# Altium schematic sheet ecar.SchDoc
size E
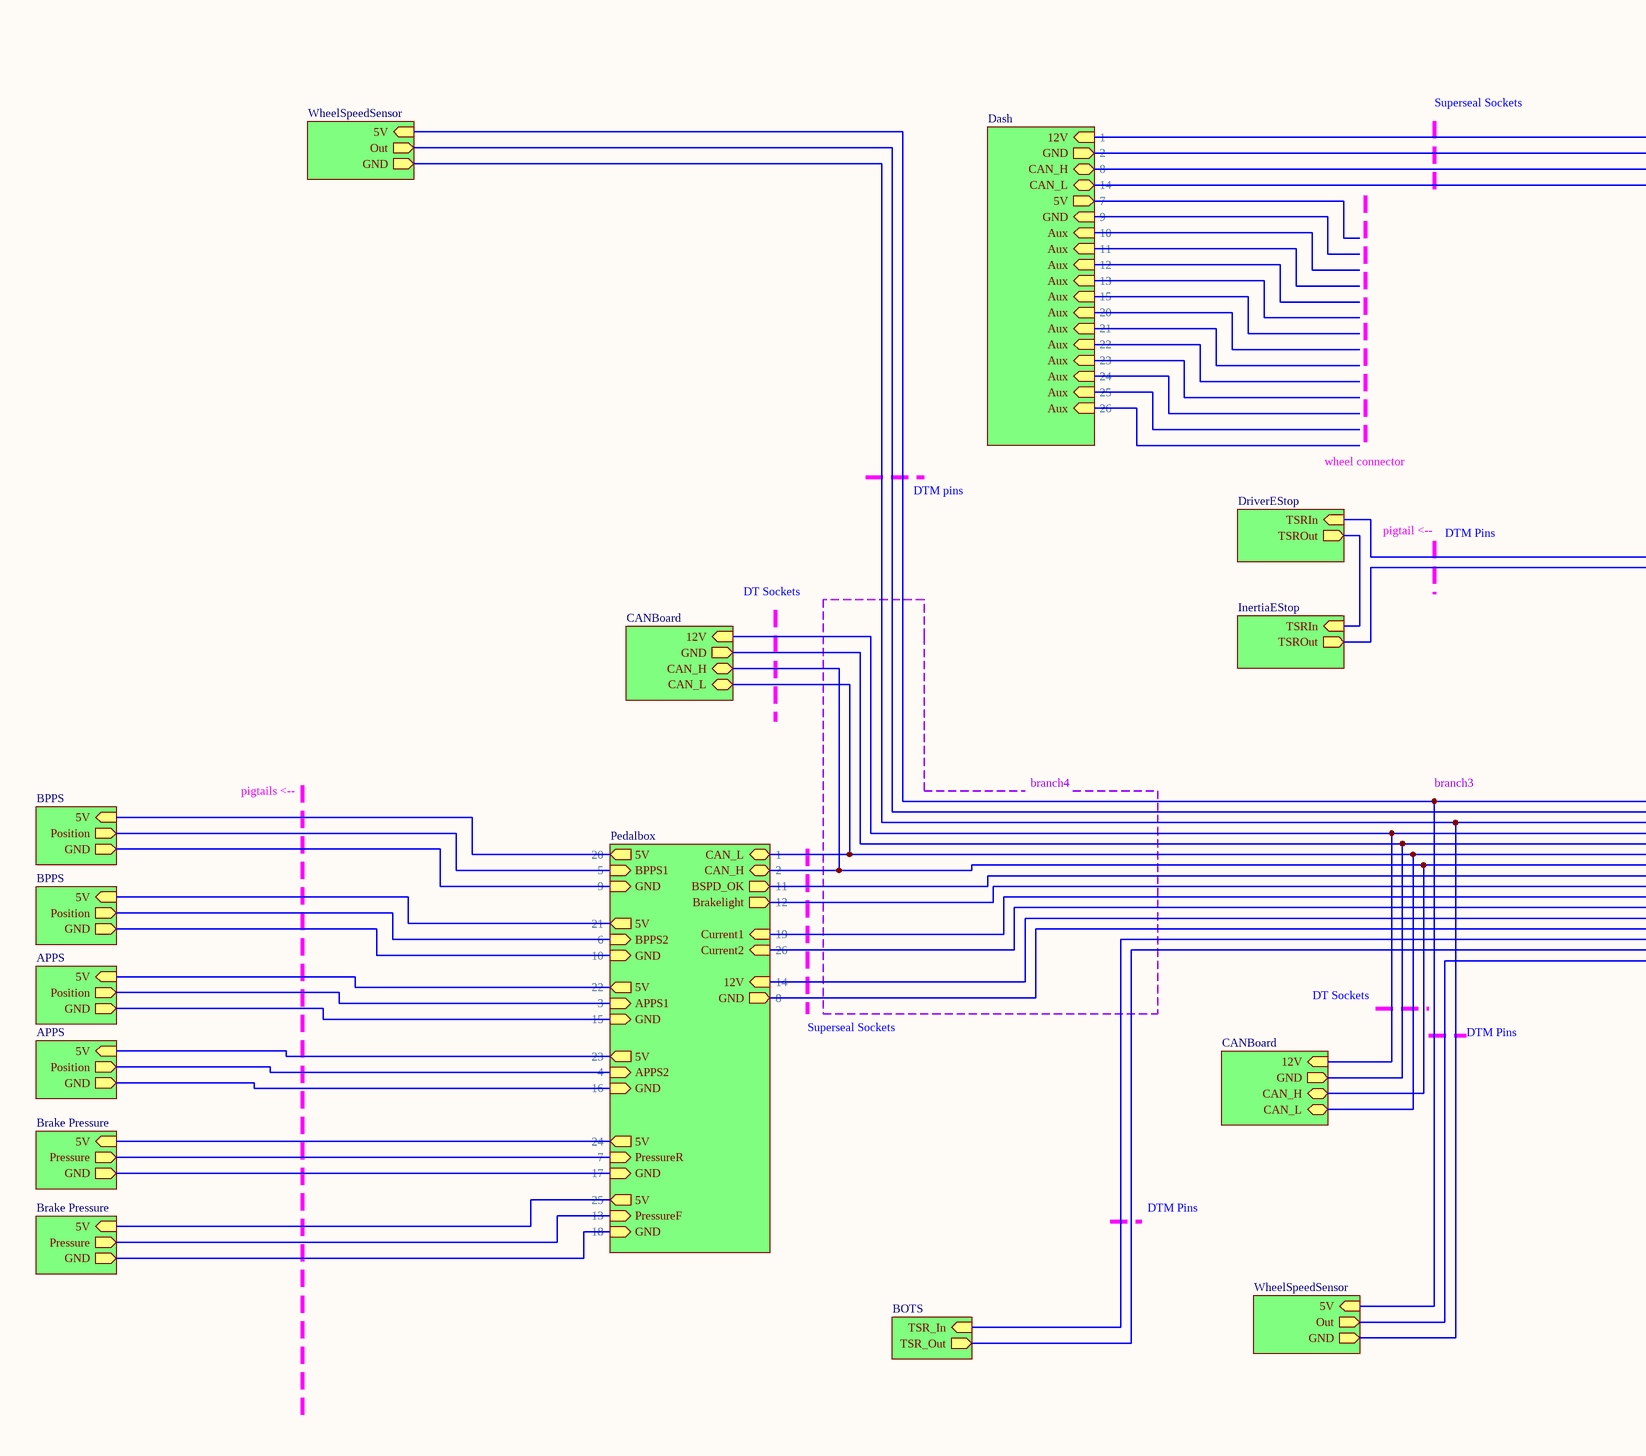
[diagram p0: ecar.SchDoc, top left]
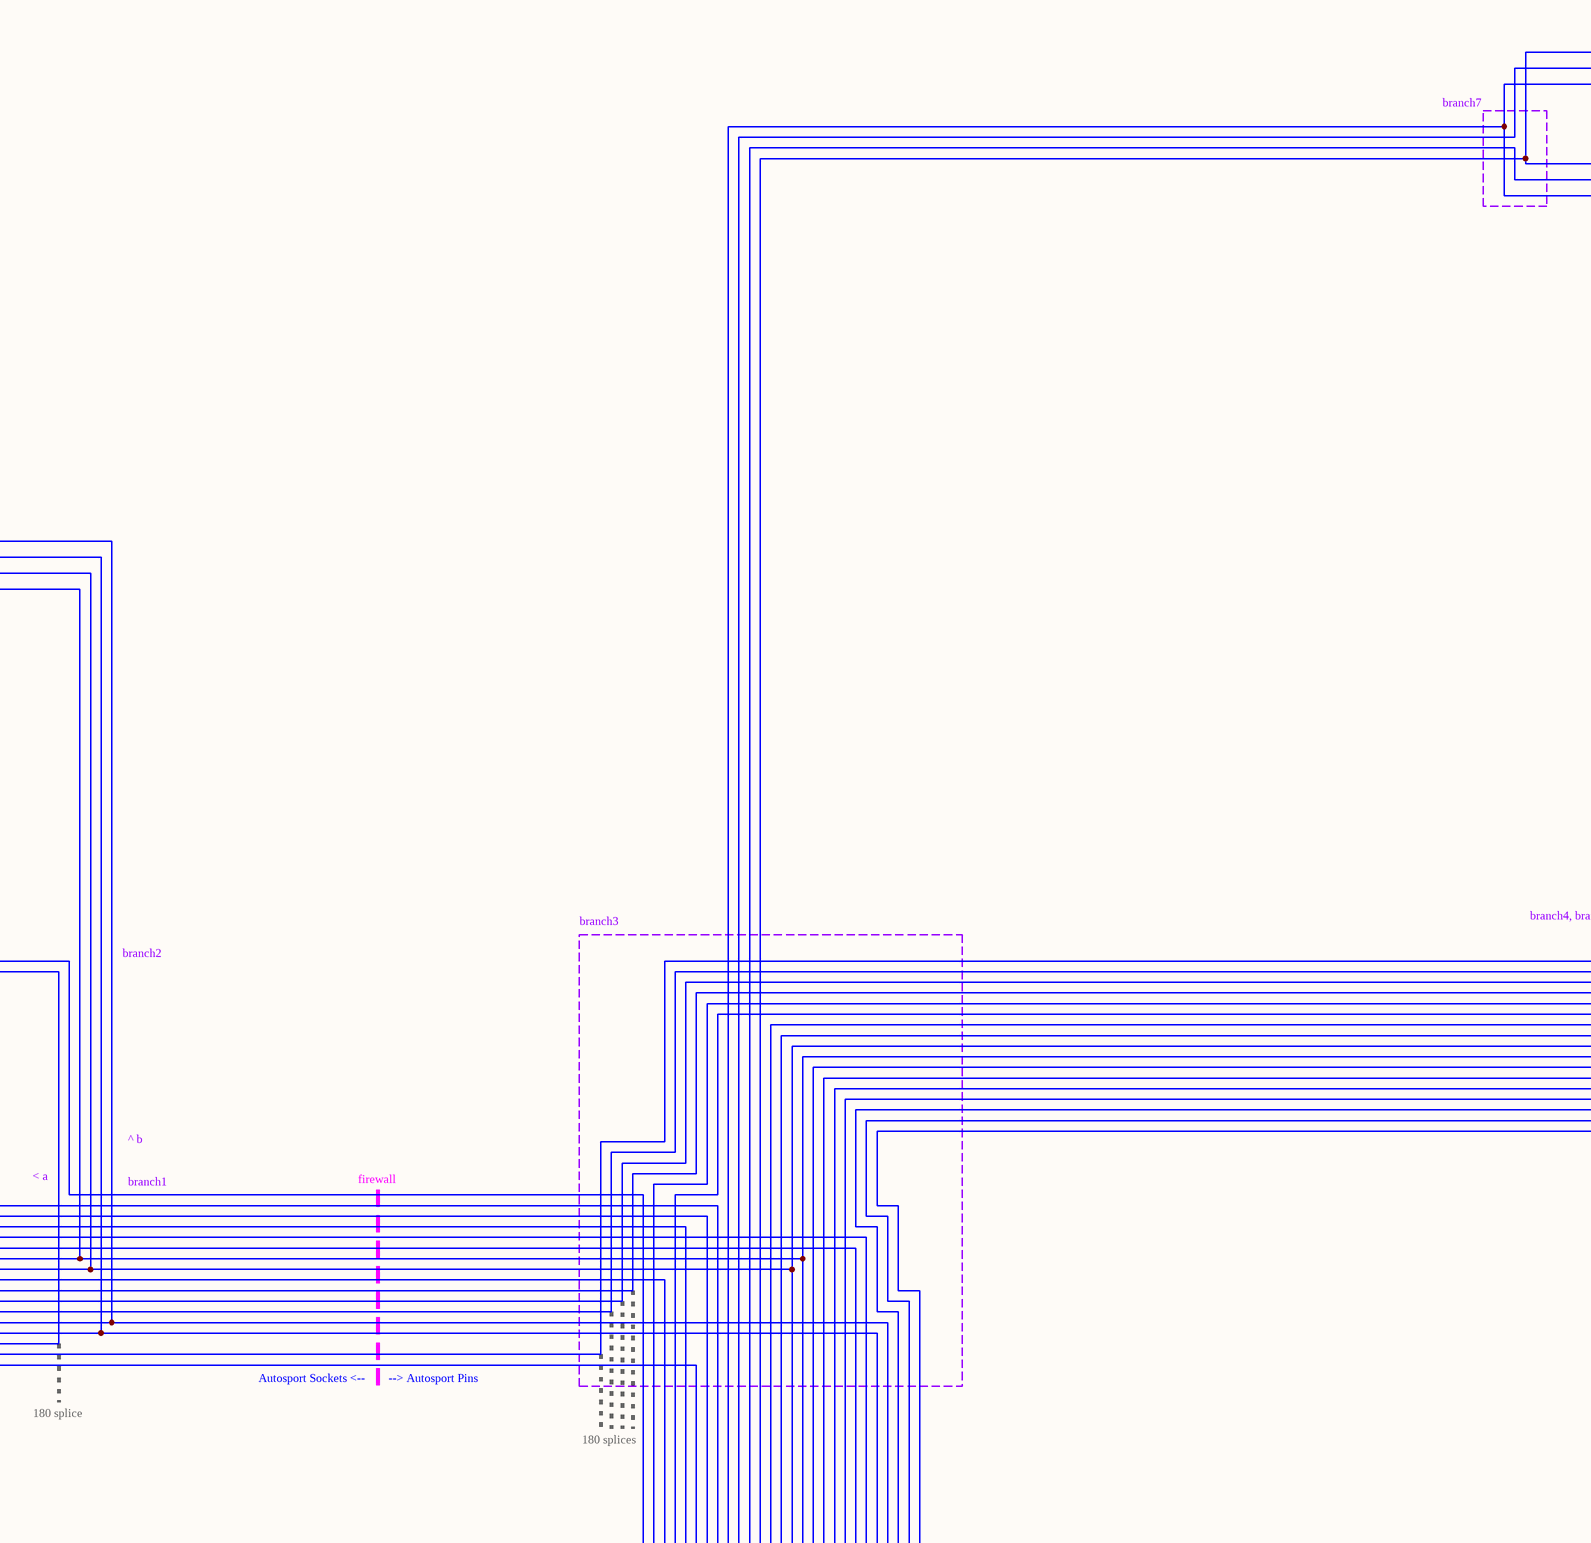
[diagram p1: ecar.SchDoc, top middle]
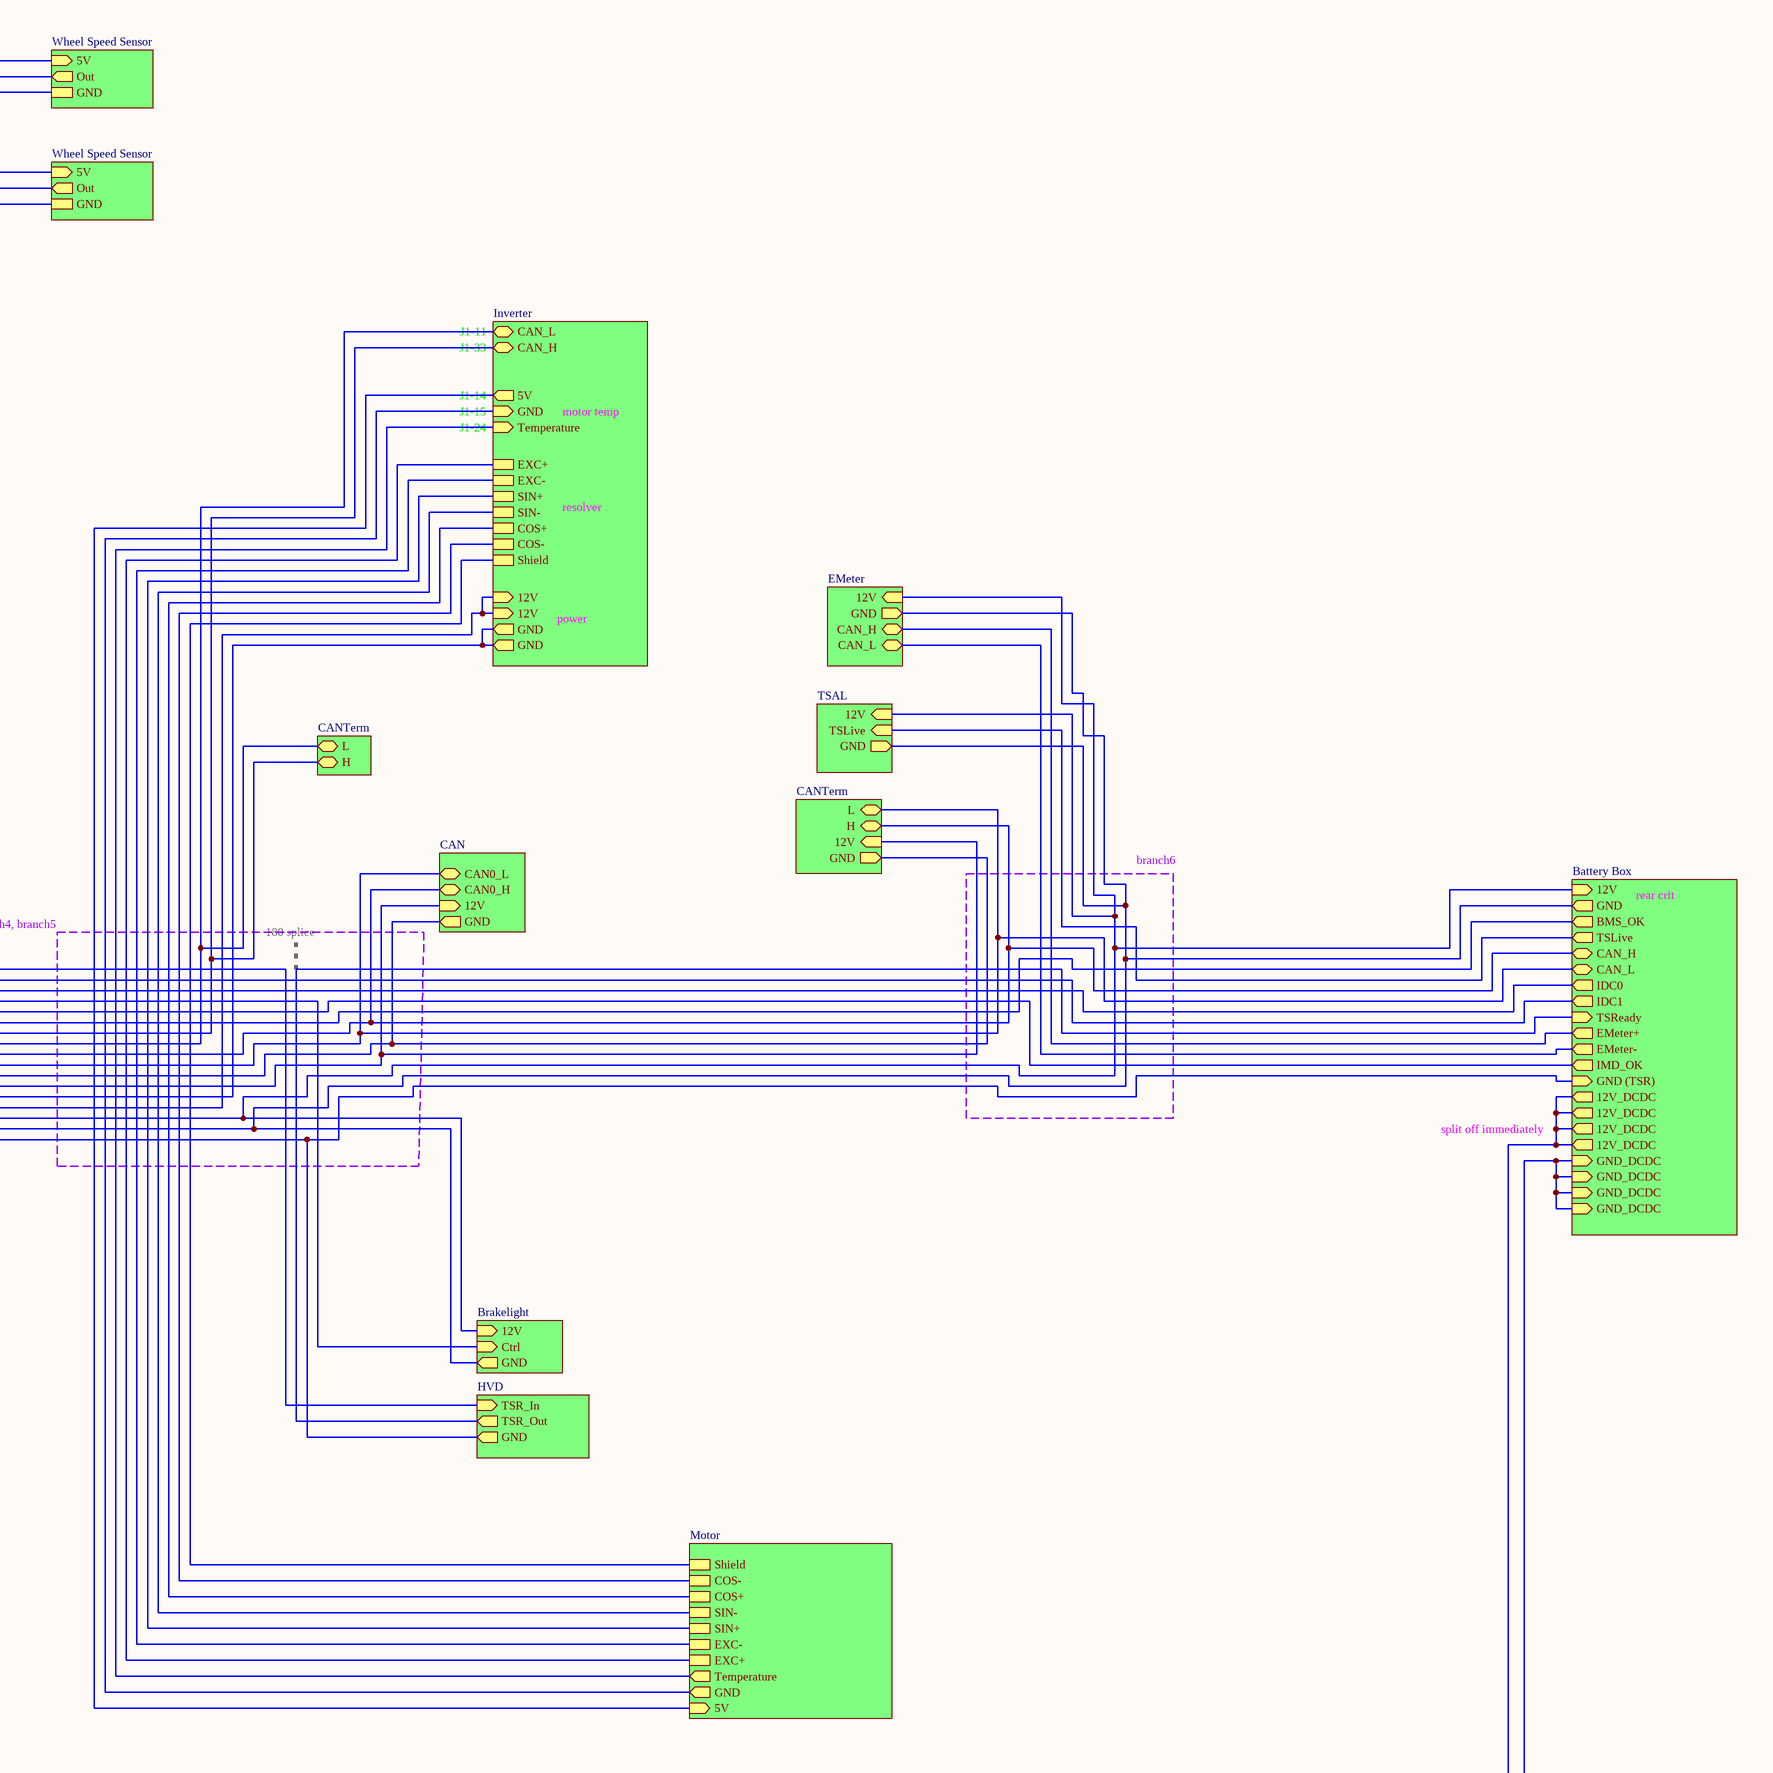
[diagram p2: ecar.SchDoc, top right]
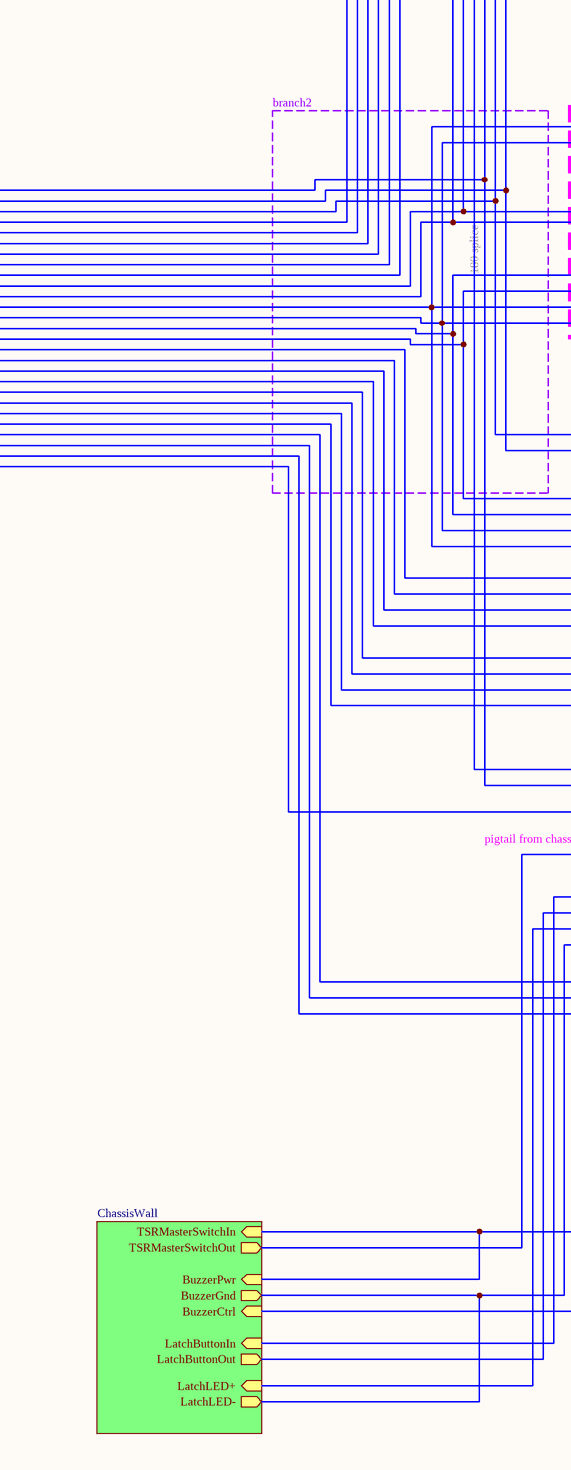
[diagram p3: ecar.SchDoc, bottom middle]
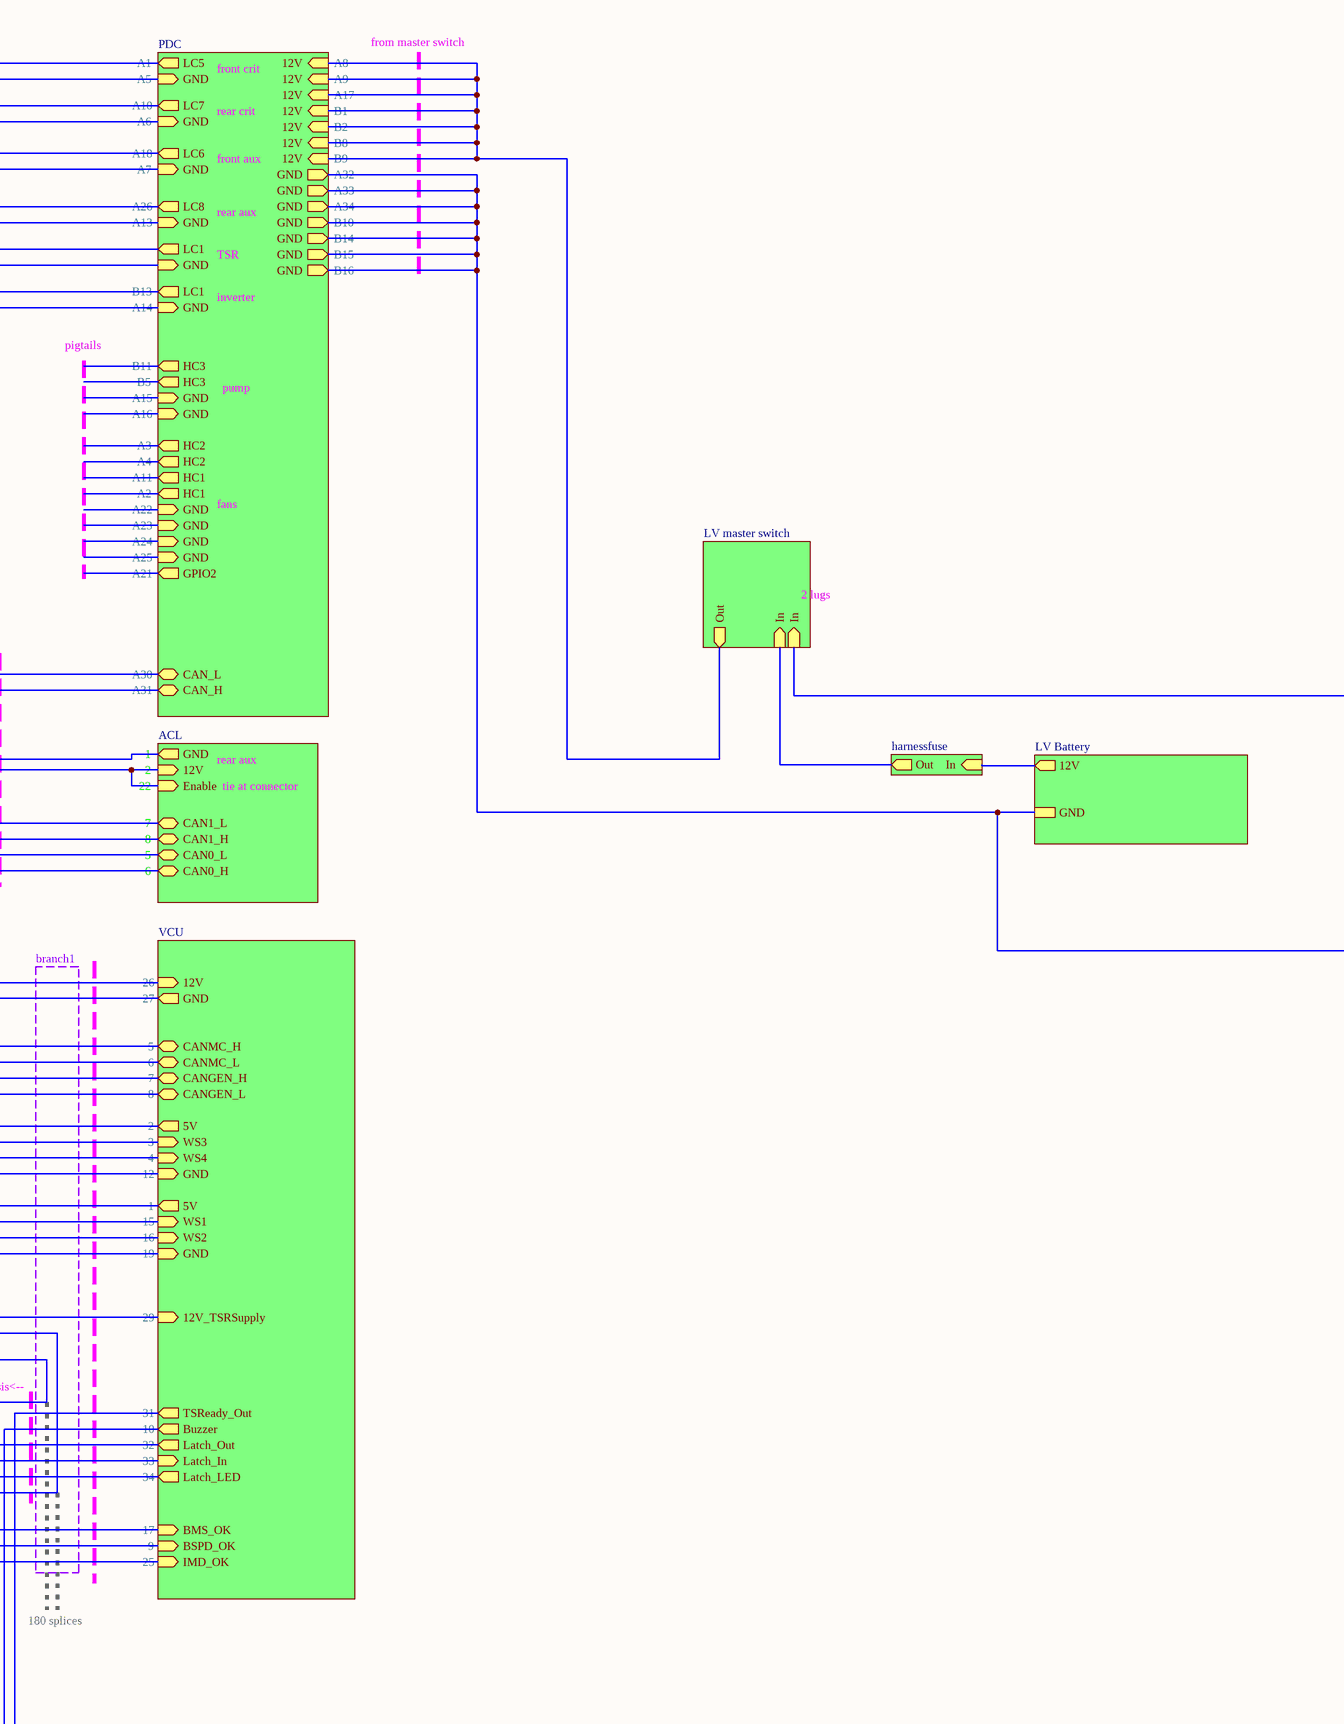
[diagram p4: ecar.SchDoc, bottom right]

## Sub-sheets
ACL = ?: GND (out), 12V (in), CAN1_L (bidir), CAN1_H (bidir), CAN0_L (bidir), CAN0_H (bidir), Enable (in)
APPS = ?: 5V (in), Position (out), GND (out)
APPS = ?: 5V (in), Position (out), GND (out)
Battery Box = ?: 12V (in), GND (out), BMS_OK (out), TSLive (out), CAN_H (bidir), CAN_L (bidir), IDC0 (out), IDC1 (out), TSReady (in), EMeter+ (out), EMeter- (out), IMD_OK (out), 12V_DCDC (out), 12V_DCDC (out), 12V_DCDC (out), 12V_DCDC (out), GND_DCDC (in), GND_DCDC (in), GND_DCDC (in), GND_DCDC (in), GND (TSR) (in)
BOTS = ?: TSR_In (in), TSR_Out (out)
BPPS = ?: 5V (in), Position (out), GND (out)
BPPS = ?: 5V (in), Position (out), GND (out)
Brake Pressure = ?: 5V (in), Pressure (out), GND (out)
Brake Pressure = ?: 5V (in), Pressure (out), GND (out)
Brakelight = ?: 12V (in), Ctrl (in), GND (out)
CAN = ?: CAN0_L (bidir), CAN0_H (bidir), 12V (in), GND (out)
CANBoard = ?: 12V (in), GND (out), CAN_H (bidir), CAN_L (bidir)
CANBoard = ?: 12V (in), GND (out), CAN_H (bidir), CAN_L (bidir)
CANTerm = ?: H (bidir), L (bidir)
CANTerm = ?: H (bidir), L (bidir), 12V (in), GND (out)
ChassisWall = ?: TSRMasterSwitchIn (in), TSRMasterSwitchOut (out), BuzzerPwr (in), BuzzerGnd (out), BuzzerCtrl (in), LatchButtonIn (in), LatchButtonOut (out), LatchLED+ (in), LatchLED- (out)
Dash = ?: 12V (in), GND (out), 5V (out), CAN_H (bidir), CAN_L (bidir), Aux (in), Aux (in), Aux (in), Aux (in), Aux (in), Aux (in), Aux (in), Aux (in), Aux (in), Aux (in), Aux (in), Aux (in), GND (in)
DriverEStop = ?: TSRIn (in), TSROut (out)
EMeter = ?: 12V (in), GND (out), CAN_H (bidir), CAN_L (bidir)
harnessfuse = ?: In (in), Out (out)
HVD = ?: TSR_In (in), TSR_Out (out), GND (out)
InertiaEStop = ?: TSRIn (in), TSROut (out)
Inverter = ?: CAN_L (bidir), 5V (out), GND (in), Temperature (in), CAN_H (bidir), EXC+, EXC-, SIN+, SIN-, COS+, COS-, Shield, 12V (in), 12V (in), GND (out), GND (out)
LV Battery = ?: 12V (out), GND
LV master switch = ?: In (in), Out (out), In (in)
Motor = ?: Shield, COS-, COS+, SIN-, SIN+, EXC-, EXC+, Temperature (out), GND (out), 5V (in)
PDC = ?: LC5 (out), HC1 (out), HC2 (out), HC2 (out), GND (in), GND (in), GND (in), 12V (in), 12V (in), LC7 (out), HC1 (out), GND (in), GND (in), GND (in), GND (in), 12V (in), LC6 (out), GPIO2 (out), GND (in), GND (in), GND (in), GND (in), LC8 (out), CAN_L (bidir), CAN_H (bidir), GND (out), GND (out), GND (out), 12V (in), 12V (in), HC3 (out), 12V (in), 12V (in), GND (out), HC3 (out), LC1 (out), GND (out), GND (out), GND (out), LC1 (out), GND (in)
Pedalbox = ?: CAN_L (bidir), CAN_H (bidir), APPS1 (in), APPS2 (in), BPPS1 (in), BPPS2 (in), PressureR (in), PressureF (in), BSPD_OK (out), Brakelight (out), GND (out), 12V (in), Current1 (in), Current2 (in), GND (in), 5V (out), 5V (out), GND (in), 5V (out), GND (in), 5V (out), GND (in), 5V (out), GND (in), 5V (out), GND (in)
TSAL = ?: 12V (in), TSLive (in), GND (out)
VCU = ?: 5V (out), 5V (out), WS3 (in), WS4 (in), CANMC_H (bidir), CANMC_L (bidir), CANGEN_H (bidir), CANGEN_L (bidir), BSPD_OK (in), Buzzer (out), GND (in), WS1 (in), WS2 (in), BMS_OK (in), GND (in), IMD_OK (in), 12V (in), GND (out), 12V_TSRSupply (in), TSReady_Out (out), Latch_Out (out), Latch_In (in), Latch_LED (out)
Wheel Speed Sensor = ?: Out (out), 5V (in), GND
Wheel Speed Sensor = ?: Out (out), 5V (in), GND
WheelSpeedSensor = ?: 5V (in), Out (out), GND (out)
WheelSpeedSensor = ?: 5V (in), Out (out), GND (out)

## Nets
(unnamed): sheet VCU/5V, sheet WheelSpeedSensor/5V, sheet WheelSpeedSensor/5V
(unnamed): sheet VCU/5V, sheet Wheel Speed Sensor/5V, sheet Wheel Speed Sensor/5V
(unnamed): sheet VCU/WS3, sheet Wheel Speed Sensor/Out
(unnamed): sheet VCU/WS4, sheet Wheel Speed Sensor/Out
(unnamed): sheet VCU/CANMC_H, sheet ACL/CAN1_H, sheet Inverter/CAN_H, sheet CANTerm/H
(unnamed): sheet VCU/CANMC_L, sheet ACL/CAN1_L, sheet Inverter/CAN_L, sheet CANTerm/L
(unnamed): sheet VCU/CANGEN_H, sheet PDC/CAN_H, sheet ACL/CAN0_H, sheet Battery Box/CAN_H, sheet Pedalbox/CAN_H, sheet Dash/CAN_H, sheet CANBoard/CAN_H, sheet CANBoard/CAN_H, sheet CANTerm/H, sheet CAN/CAN0_H
(unnamed): sheet VCU/CANGEN_L, sheet PDC/CAN_L, sheet ACL/CAN0_L, sheet Battery Box/CAN_L, sheet Pedalbox/CAN_L, sheet Dash/CAN_L, sheet CANBoard/CAN_L, sheet CANBoard/CAN_L, sheet CANTerm/L, sheet CAN/CAN0_L
(unnamed): sheet VCU/BSPD_OK, sheet Pedalbox/BSPD_OK
(unnamed): sheet VCU/Buzzer, sheet ChassisWall/BuzzerCtrl
(unnamed): sheet VCU/GND, sheet Wheel Speed Sensor/GND, sheet Wheel Speed Sensor/GND
(unnamed): sheet VCU/WS1, sheet WheelSpeedSensor/Out
(unnamed): sheet VCU/WS2, sheet WheelSpeedSensor/Out
(unnamed): sheet VCU/BMS_OK, sheet Battery Box/BMS_OK
(unnamed): sheet VCU/GND, sheet WheelSpeedSensor/GND, sheet WheelSpeedSensor/GND
(unnamed): sheet VCU/IMD_OK, sheet Battery Box/IMD_OK
(unnamed): sheet VCU/12V, sheet PDC/LC7, sheet Battery Box/12V, sheet Brakelight/12V, sheet TSAL/12V, sheet EMeter/12V
(unnamed): sheet VCU/GND, sheet PDC/GND, sheet Battery Box/GND, sheet Brakelight/GND, sheet TSAL/GND, sheet EMeter/GND
(unnamed): sheet VCU/12V_TSRSupply, sheet PDC/LC1
(unnamed): sheet VCU/TSReady_Out, sheet ChassisWall/TSRMasterSwitchIn, sheet ChassisWall/BuzzerPwr
(unnamed): sheet VCU/Latch_Out, sheet ChassisWall/LatchButtonIn
(unnamed): sheet VCU/Latch_In, sheet ChassisWall/LatchButtonOut
(unnamed): sheet VCU/Latch_LED, sheet ChassisWall/LatchLED+
(unnamed): sheet PDC/LC5, sheet Pedalbox/12V, sheet Dash/12V
(unnamed): sheet PDC/GND, sheet Pedalbox/GND, sheet Dash/GND
(unnamed): sheet PDC/GND, sheet CANBoard/GND, sheet CANBoard/GND
(unnamed): sheet PDC/12V, sheet PDC/12V, sheet PDC/12V, sheet PDC/12V, sheet PDC/12V, sheet PDC/12V, sheet PDC/12V, sheet LV master switch/Out
(unnamed): sheet PDC/GND, sheet ACL/GND, sheet CANTerm/GND, sheet CAN/GND
(unnamed): sheet PDC/GND, sheet Inverter/GND, sheet Inverter/GND
(unnamed): sheet PDC/LC6, sheet CANBoard/12V, sheet CANBoard/12V
(unnamed): sheet PDC/LC8, sheet ACL/12V, sheet ACL/Enable, sheet CANTerm/12V, sheet CAN/12V
(unnamed): sheet PDC/GND, sheet PDC/GND, sheet PDC/GND, sheet PDC/GND, sheet PDC/GND, sheet PDC/GND, sheet PDC/GND, sheet LV Battery/GND, sheet Battery Box/GND_DCDC, sheet Battery Box/GND_DCDC, sheet Battery Box/GND_DCDC, sheet Battery Box/GND_DCDC
(unnamed): sheet PDC/LC1, sheet Inverter/12V, sheet Inverter/12V
(unnamed): sheet PDC/GND, sheet Battery Box/GND (TSR), sheet HVD/GND, sheet ChassisWall/BuzzerGnd, sheet ChassisWall/LatchLED-
(unnamed): sheet LV Battery/12V, sheet harnessfuse/In
(unnamed): sheet harnessfuse/Out, sheet LV master switch/In
(unnamed): sheet LV master switch/In, sheet Battery Box/12V_DCDC, sheet Battery Box/12V_DCDC, sheet Battery Box/12V_DCDC, sheet Battery Box/12V_DCDC
(unnamed): sheet Inverter/5V, sheet Motor/5V
(unnamed): sheet Inverter/GND, sheet Motor/GND
(unnamed): sheet Inverter/Temperature, sheet Motor/Temperature
(unnamed): sheet Inverter/EXC+, sheet Motor/EXC+
(unnamed): sheet Inverter/EXC-, sheet Motor/EXC-
(unnamed): sheet Inverter/SIN+, sheet Motor/SIN+
(unnamed): sheet Inverter/SIN-, sheet Motor/SIN-
(unnamed): sheet Inverter/COS+, sheet Motor/COS+
(unnamed): sheet Inverter/COS-, sheet Motor/COS-
(unnamed): sheet Inverter/Shield, sheet Motor/Shield
(unnamed): sheet Battery Box/TSLive, sheet TSAL/TSLive
(unnamed): sheet Battery Box/IDC0, sheet Pedalbox/Current1
(unnamed): sheet Battery Box/IDC1, sheet Pedalbox/Current2
(unnamed): sheet Battery Box/TSReady, sheet HVD/TSR_Out
(unnamed): sheet Battery Box/EMeter+, sheet EMeter/CAN_H
(unnamed): sheet Battery Box/EMeter-, sheet EMeter/CAN_L
(unnamed): sheet HVD/TSR_In, sheet BOTS/TSR_Out
(unnamed): sheet Pedalbox/APPS1, sheet APPS/Position
(unnamed): sheet Pedalbox/APPS2, sheet APPS/Position
(unnamed): sheet Pedalbox/BPPS1, sheet BPPS/Position
(unnamed): sheet Pedalbox/BPPS2, sheet BPPS/Position
(unnamed): sheet Pedalbox/PressureR, sheet Brake Pressure/Pressure
(unnamed): sheet Pedalbox/PressureF, sheet Brake Pressure/Pressure
(unnamed): sheet Pedalbox/Brakelight, sheet Brakelight/Ctrl
(unnamed): sheet Pedalbox/GND, sheet BPPS/GND
(unnamed): sheet Pedalbox/5V, sheet BPPS/5V
(unnamed): sheet Pedalbox/5V, sheet BPPS/5V
(unnamed): sheet Pedalbox/GND, sheet BPPS/GND
(unnamed): sheet Pedalbox/5V, sheet APPS/5V
(unnamed): sheet Pedalbox/GND, sheet APPS/GND
(unnamed): sheet Pedalbox/5V, sheet APPS/5V
(unnamed): sheet Pedalbox/GND, sheet APPS/GND
(unnamed): sheet Pedalbox/5V, sheet Brake Pressure/5V
(unnamed): sheet Pedalbox/GND, sheet Brake Pressure/GND
(unnamed): sheet Pedalbox/5V, sheet Brake Pressure/5V
(unnamed): sheet Pedalbox/GND, sheet Brake Pressure/GND
(unnamed): sheet BOTS/TSR_In, sheet InertiaEStop/TSROut
(unnamed): sheet DriverEStop/TSRIn, sheet ChassisWall/TSRMasterSwitchOut
(unnamed): sheet DriverEStop/TSROut, sheet InertiaEStop/TSRIn

## Notes on the sheet
- branch7
- J1-11
- J1-14
- J1-33
- J1-15
- J1-24
- motor temp
- Superseal Sockets
- resolver
- 1
- 2
- 8
- 14
- 7
- 9
- 10
- 11
- power
- 12
- 13
- 15
- 20
- 21
- 22
- 23
- 24
- 25
- 26
- wheel connector
- branch6
- DTM pins
- pigtail <--
- branch3
- branch4, branch5
- 180 splice
- rear crit
- DT Sockets
- DTM Pins
- branch2
- split off immediately
- pigtails <--
- branch4
- < a
- branch1
- ^ b
- firewall
- 5
- 19
- 3
- 6
- Autosport Sockets <--
- --> Autosport Pins
- 4
- 180 splices
- 16
- 17
- 18
- A1
- A5
- front crit
- A8
- A9
- from master switch
- A10
- A6
- A17
- B1
- B2
- B8
- A18
- A26
- A7
- front aux
- rear aux
- A32
- A33
- A34
- B9
- A13
- TSR
- B10
- B14
- B15
- B16
- pigtails
- A14
- B13
- inverter
- A15
- A16
- B11
- B5
- pump
- A11
- A3
- A4
- A22
- A23
- A24
- A2
- fans
- A21
- A25
- 2 lugs
- A30
- A31
- tie at connector
- 27
- 29
- pigtail from chassis<--
- 31
- 32
- 33
- 34
- Title
- Size:
- Date:
- File:
- E
- Number:
- Time:
- Revision:
- Sheet
- of